# Altium schematic sheet fpga-bank8-outside.SchDoc: FPGA - Bank 8
size Letter; CheckedBy: E. Chiu; CompanyName: Brinton Engineering, LLC; DrawnBy: J. Brinton; Engineer: J. Brinton; Address1: 3479 Edison Way; Address2: Menlo Park CA 94025; Address3: +1 (877) 778-8435; Address4: brintonengineering.com; Revision: 1; SheetNumber: 15; SheetTotal: 48
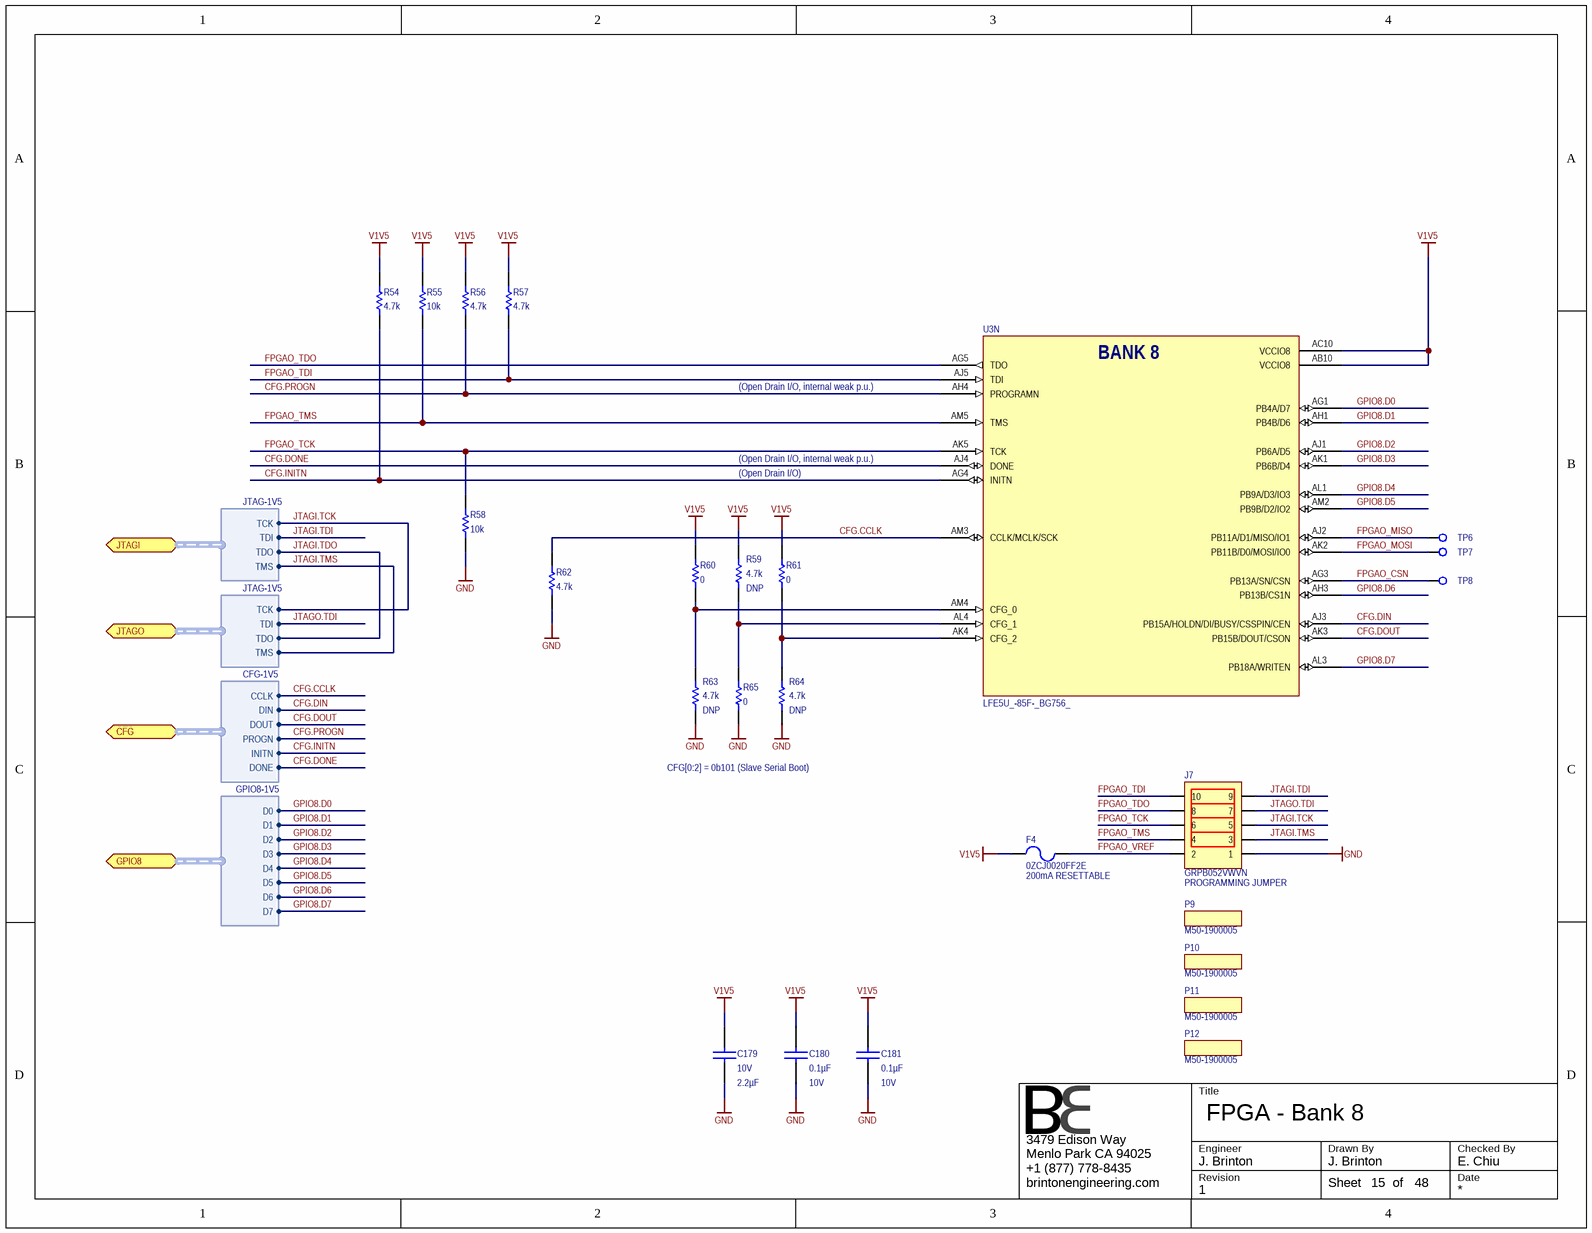
[diagram p0: fpga-bank8-outside.SchDoc]

## Parts
C179  Voltage - Rated: 10V  Capacitance: 2.2µF  [CAPC1608X90N]  (hidden comment: GRM188R71A225KE15D)
C180  Capacitance: 0.1µF  Voltage - Rated: 10V  [CAPC1005X56N]  (hidden comment: GRM155R71A104KA01J)
C181  Capacitance: 0.1µF  Voltage - Rated: 10V  [CAPC1005X56N]  (hidden comment: GRM155R71A104KA01J)
F4  0ZCJ0020FF2E  [1206]
J7  GRPB052VWVN  [GRPB052VWVN]
P9  M50-1900005  (mechanical)
P10  M50-1900005  (mechanical)
P11  M50-1900005  (mechanical)
P12  M50-1900005  (mechanical)
R54  value 4.7k  [0603]  (hidden comment: RES 0603 4.7k 1%)
R55  value 10k  [0603]  (hidden comment: ERJ-3EKF1002V)
R56  value 4.7k  [0603]  (hidden comment: RES 0603 4.7k 1%)
R57  value 4.7k  [0603]  (hidden comment: RES 0603 4.7k 1%)
R58  value 10k  [0603]  (hidden comment: ERJ-3EKF1002V)
R59  value 4.7k  Do Not Place: DNP  [0603]  (hidden comment: RES 0603 4.7k 1%)
R60  value 0  [0603]  (hidden comment: RES 0603 0)
R61  value 0  [0603]  (hidden comment: RES 0603 0)
R62  value 4.7k  [0603]  (hidden comment: RES 0603 4.7k 1%)
R63  value 4.7k  Do Not Place: DNP  [0603]  (hidden comment: RES 0603 4.7k 1%)
R64  value 4.7k  Do Not Place: DNP  [0603]  (hidden comment: RES 0603 4.7k 1%)
R65  value 0  [0603]  (hidden comment: RES 0603 0)
TP6  TEST_POINT_SMD_10  [TEST_POINT_SMD_10]  (value not drawn)  (no BOM)
TP7  TEST_POINT_SMD_10  [TEST_POINT_SMD_10]  (value not drawn)  (no BOM)
TP8  TEST_POINT_SMD_10  [TEST_POINT_SMD_10]  (value not drawn)  (no BOM)
U3  LFE5U_-85F-_BG756_  [caBGA756]  (part N of 19)

## Ports
CFG (harness CFG-1V5), GPIO8 (harness GPIO8-1V5), JTAGI (harness JTAG-1V5), JTAGO (harness JTAG-1V5)

## Harnesses
CFG-1V5: CCLK, DIN, DOUT, PROGN, INITN, DONE
GPIO8-1V5: D0, D1, D2, D3, D4, D5, D6, D7
JTAG-1V5: TMS, TCK, TDI, TDO

## Nets
GND: C179.1 C180.1 C181.1 J7.1 R58.1 R62.1 R63.1 R64.1 R65.1
V1V5: C179.2 C180.2 C181.2 F4.1 R54.2 R55.2 R56.2 R57.2 R59.2 R60.2 R61.2 U3.AB10(VCCIO8) U3.AC10(VCCIO8)
CFG.CCLK: R62.2 U3.AM3(CCLK/MCLK/SCK) ; port CFG.CCLK
CFG.DIN: U3.AJ3(PB15A/HOLDN/DI/BUSY/CSSPIN/CEN) ; port CFG.DIN
CFG.DONE: U3.AJ4(DONE) ; port CFG.DONE
CFG.DOUT: U3.AK3(PB15B/DOUT/CSON) ; port CFG.DOUT
CFG.INITN: R54.1 U3.AG4(INITN) ; port CFG.INITN
CFG.PROGN: R56.1 U3.AH4(PROGRAMN) ; port CFG.PROGN
FPGAO_CSN: TP8.1 U3.AG3(PB13A/SN/CSN)
FPGAO_MISO: TP6.1 U3.AJ2(PB11A/D1/MISO/IO1)
FPGAO_MOSI: TP7.1 U3.AK2(PB11B/D0/MOSI/IO0)
FPGAO_TCK: J7.6 R58.2 U3.AK5(TCK)
FPGAO_TDI: J7.10 R57.1 U3.AJ5(TDI)
FPGAO_TDO: J7.8 U3.AG5(TDO)
FPGAO_TMS: J7.4 R55.1 U3.AM5(TMS)
FPGAO_VREF: F4.2 J7.2
GPIO8.D0: U3.AG1(PB4A/D7) ; port GPIO8.D0
GPIO8.D1: U3.AH1(PB4B/D6) ; port GPIO8.D1
GPIO8.D2: U3.AJ1(PB6A/D5) ; port GPIO8.D2
GPIO8.D3: U3.AK1(PB6B/D4) ; port GPIO8.D3
GPIO8.D4: U3.AL1(PB9A/D3/IO3) ; port GPIO8.D4
GPIO8.D5: U3.AM2(PB9B/D2/IO2) ; port GPIO8.D5
GPIO8.D6: U3.AH3(PB13B/CS1N) ; port GPIO8.D6
GPIO8.D7: U3.AL3(PB18A/WRITEN) ; port GPIO8.D7
JTAGI.TCK: J7.5 ; port JTAGI.TCK, port JTAGO.TCK
JTAGI.TDI: J7.9 ; port JTAGI.TDI
JTAGI.TDO: port JTAGI.TDO, port JTAGO.TDO
JTAGI.TMS: J7.3 ; port JTAGI.TMS, port JTAGO.TMS
JTAGO.TDI: J7.7 ; port JTAGO.TDI
NetR59_1: R59.1 R65.2 U3.AL4(CFG_1)
NetR60_1: R60.1 R63.2 U3.AM4(CFG_0)
NetR61_1: R61.1 R64.2 U3.AK4(CFG_2)

## Notes on the sheet
- (Open Drain I/O, internal weak p.u.)
- (Open Drain I/O)
- CFG[0:2] = 0b101 (Slave Serial Boot)
- (near F4) 200mA RESETTABLE
- PROGRAMMING JUMPER
- Title
- Engineer
- Revision
- Drawn By
- Checked By
- Date
- Sheet
- of
- (in symbol LFE5U_-85F-_BG756_, part N) BANK 8

## Library data of the parts
C179 = GRM188R71A225KE15D: CAP CER 2.2UF 10V 10% X7R 0603; Manufacturer: Murata Electronics North America; Manufacturer P/N: GRM188R71A225KE15D; Operating Temperature: -55°C ~ 125°C; Thickness (Max): 0.035" (0.90mm); Tolerance: ±10%; Package / Case: 0603 (1608 Metric); Temperature Coefficient: X7R; Supplier 1: Newark; Supplier 2: Digi-Key; RoHS: RoHS Compliant; Size / Dimension: 0.063" L x 0.031" W (1.60mm x 0.80mm); Mounting Type: Surface Mount, MLCC; ComponentLink1URL: http://www.murata.com/~/media/webrenewal/support/library/catalog/products/capacitor/mlcc/c02e.ashx; ComponentLink1Description: http://www.murata.com/~/media/webrenewal/support/library/catalog/products/capacitor/mlcc/c02e.ashx; Supplier Part Number 1: 72R4209; Supplier Part Number 2: 490-4520-1-ND
C180 C181 = GRM155R71A104KA01J: CAP CER 0.1UF 10V 10% X7R 0402; Manufacturer: Murata Electronics North America; Manufacturer P/N: GRM155R71A104KA01J; Operating Temperature: -55°C ~ 125°C; Thickness (Max): 0.022" (0.55mm); Size / Dimension: 0.039" L x 0.020" W (1.00mm x 0.50mm); RoHS: RoHS Compliant; Mounting Type: Surface Mount, MLCC; Supplier 1: Digi-Key; ComponentLink1URL: http://www.murata.com/~/media/webrenewal/support/library/catalog/products/capacitor/mlcc/c02e.ashx; ComponentLink1Description: http://www.murata.com/~/media/webrenewal/support/library/catalog/products/capacitor/mlcc/c02e.ashx; Supplier Part Number 1: 490-6322-1-ND; Temperature Coefficient: X7R; Package / Case: 0402 (1005 Metric); Tolerance: ±10%
F4 = 0ZCJ0020FF2E: PTC Resettable Fuse, 0.2A, 30V, SMD 1206; Manufacturer: Bell Fuse; Manufacturer P/N: 0ZCJ0020FF2E
J7 = GRPB052VWVN: Male Header, 0.050" Pitch, 2x5 Position; Manufacturer: Sullins; Manufacturer P/N: GRPB052VWVN
P9-P12 = M50-1900005: 1.27mm Jumper Socket; Manufacturer: Harwin; Manufacturer P/N: M50-1900005
R54 R56 R57 R59 R62-R64 = RES 0603 10k 1%: Thick Film Resistor 4.7k Ohms +/-1% 0.1W 75V SMD 0603; Manufacturer: Panasonic - ECG; Manufacturer P/N: ERJ3EKF4701V; Tcr: +/-100; Tr: -55:+155; Tolerance: +/-1%; Alternatives: *; Voltage: 75V; Power: 0.1W; P/N: ERJ3EKF4701V
R55 R58 = RES 0603 10k 1%: Thick Film Resistor 10k Ohms +/-1% 0.1W SMD 0603; Manufacturer: Panasonic - ECG; Tcr: +/-100; Tr: -55:+155; Tolerance: +/-1%; Manufacturer P/N: ERJ-3EKF1002V; Alternatives: *; Power: 0.1W; P/N: ERJ-3EKF1002V
R60 R61 R65 = RES 0603 10k 1%: Thick Film Resistor 0 Ohms SMD 0603; Manufacturer: Panasonic - ECG; Manufacturer P/N: ERJ-3GEY0R00V; Tcr: +/-100; Tolerance: +/-1%; Tr: -55:+155; Voltage: 75V; Power: 0.1W; Alternatives: *; P/N: ERJ-3GEY0R00V
TP6-TP8 = TEST_POINT_SMD_10: Test Point SMD
U3 = LFE5U_-85F-_BG756_: ECP5 FPGA, 85k LUT, 756-caBGA; Manufacturer: Lattice Semiconductor; Manufacturer P/N: LFE5U_-85F-_BG756_